# EasyEDA Pro project ProProject_OSC_Ver0.2_2023-11-09.epro, board PCB7
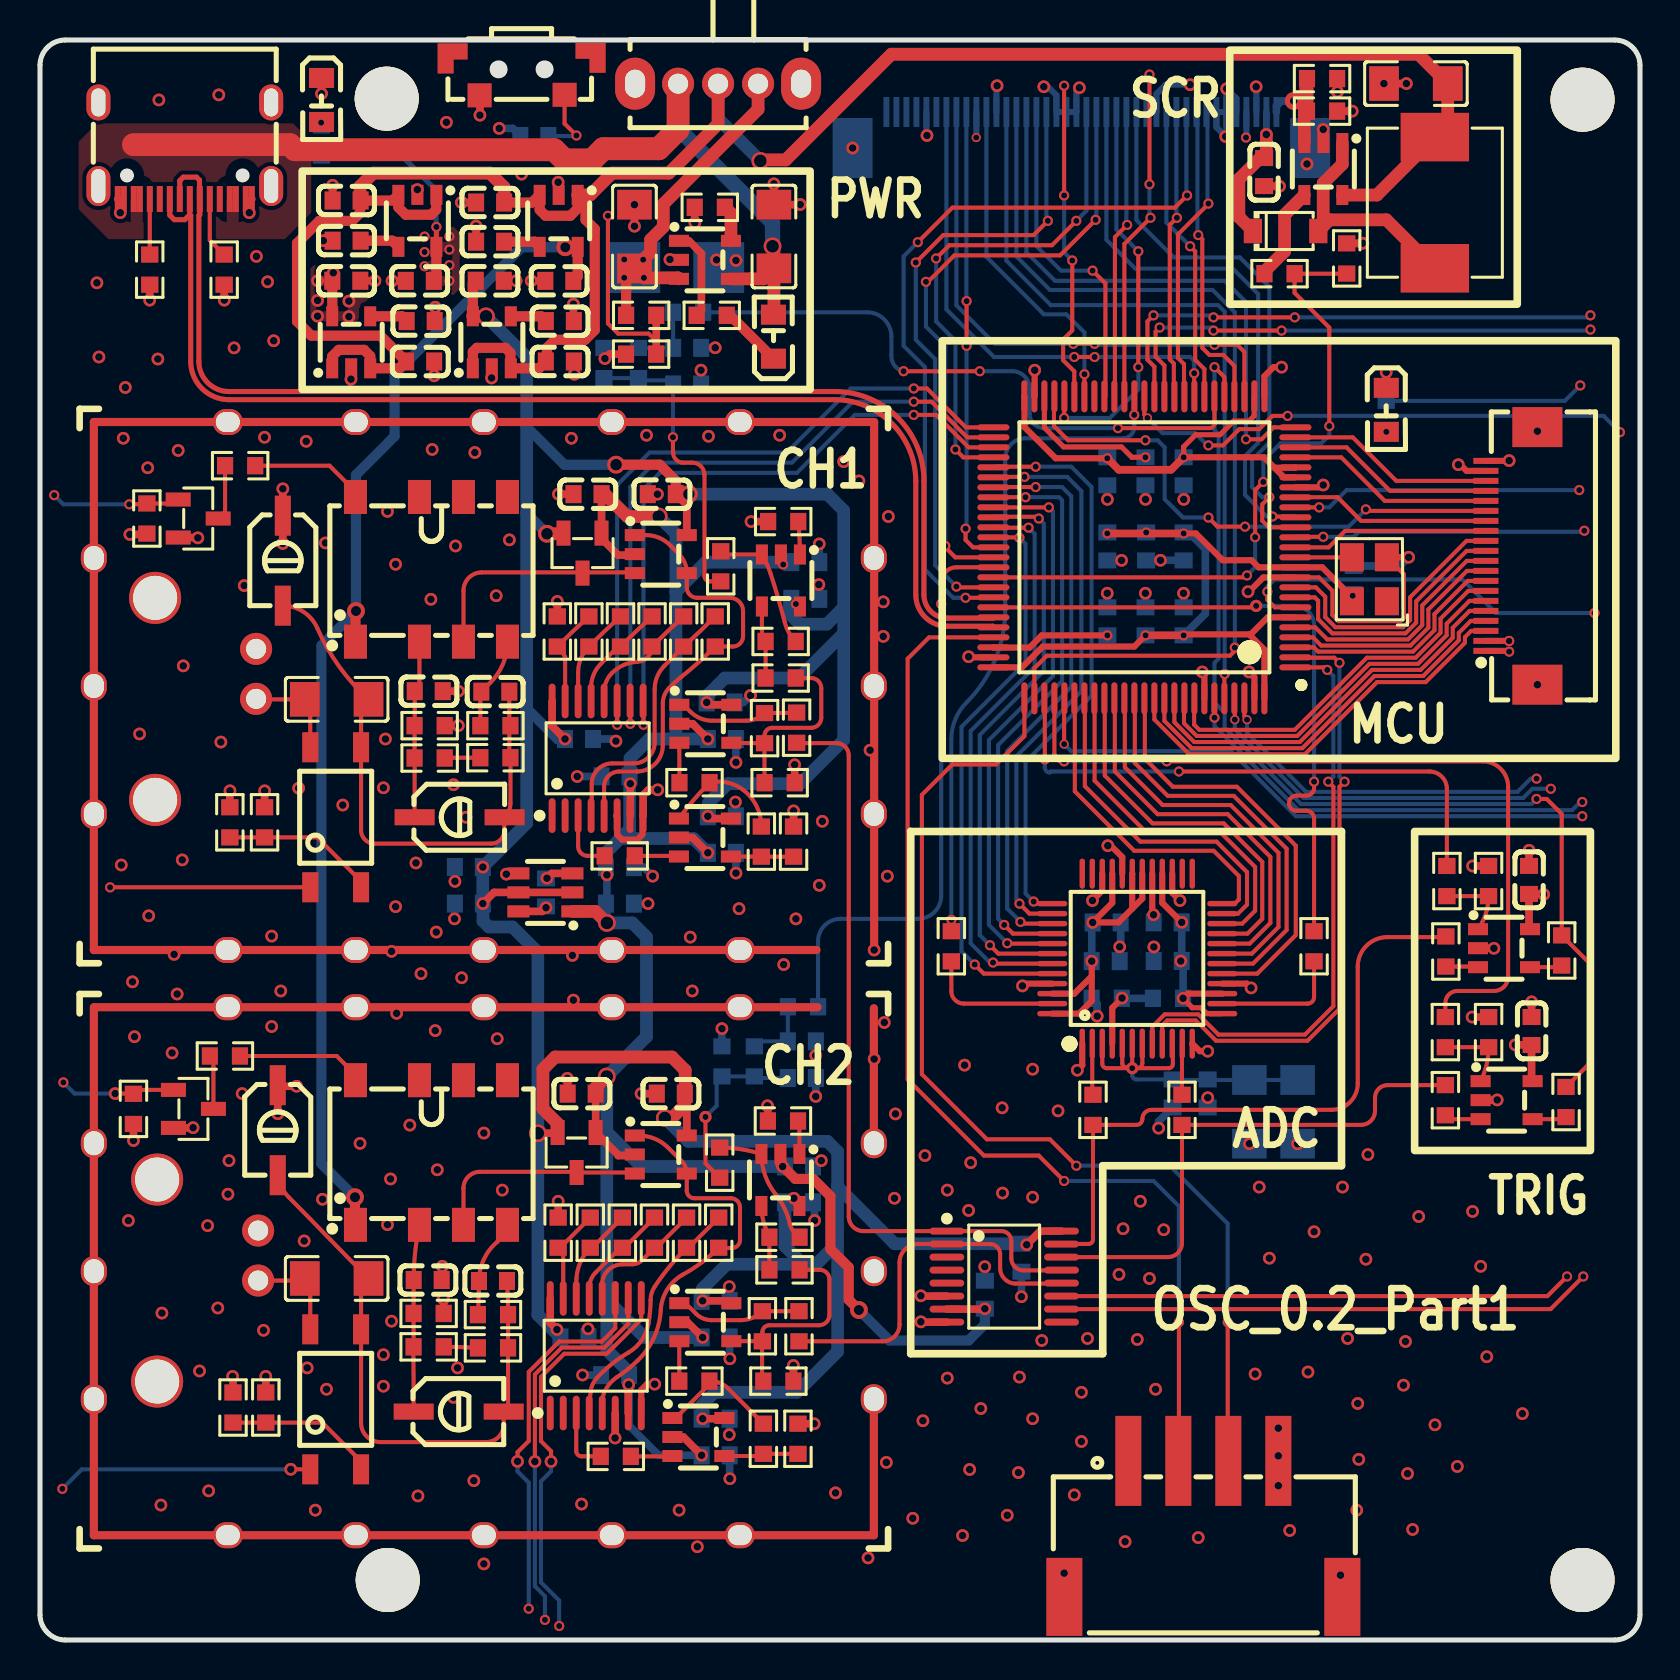
[diagram p10: board, top side]
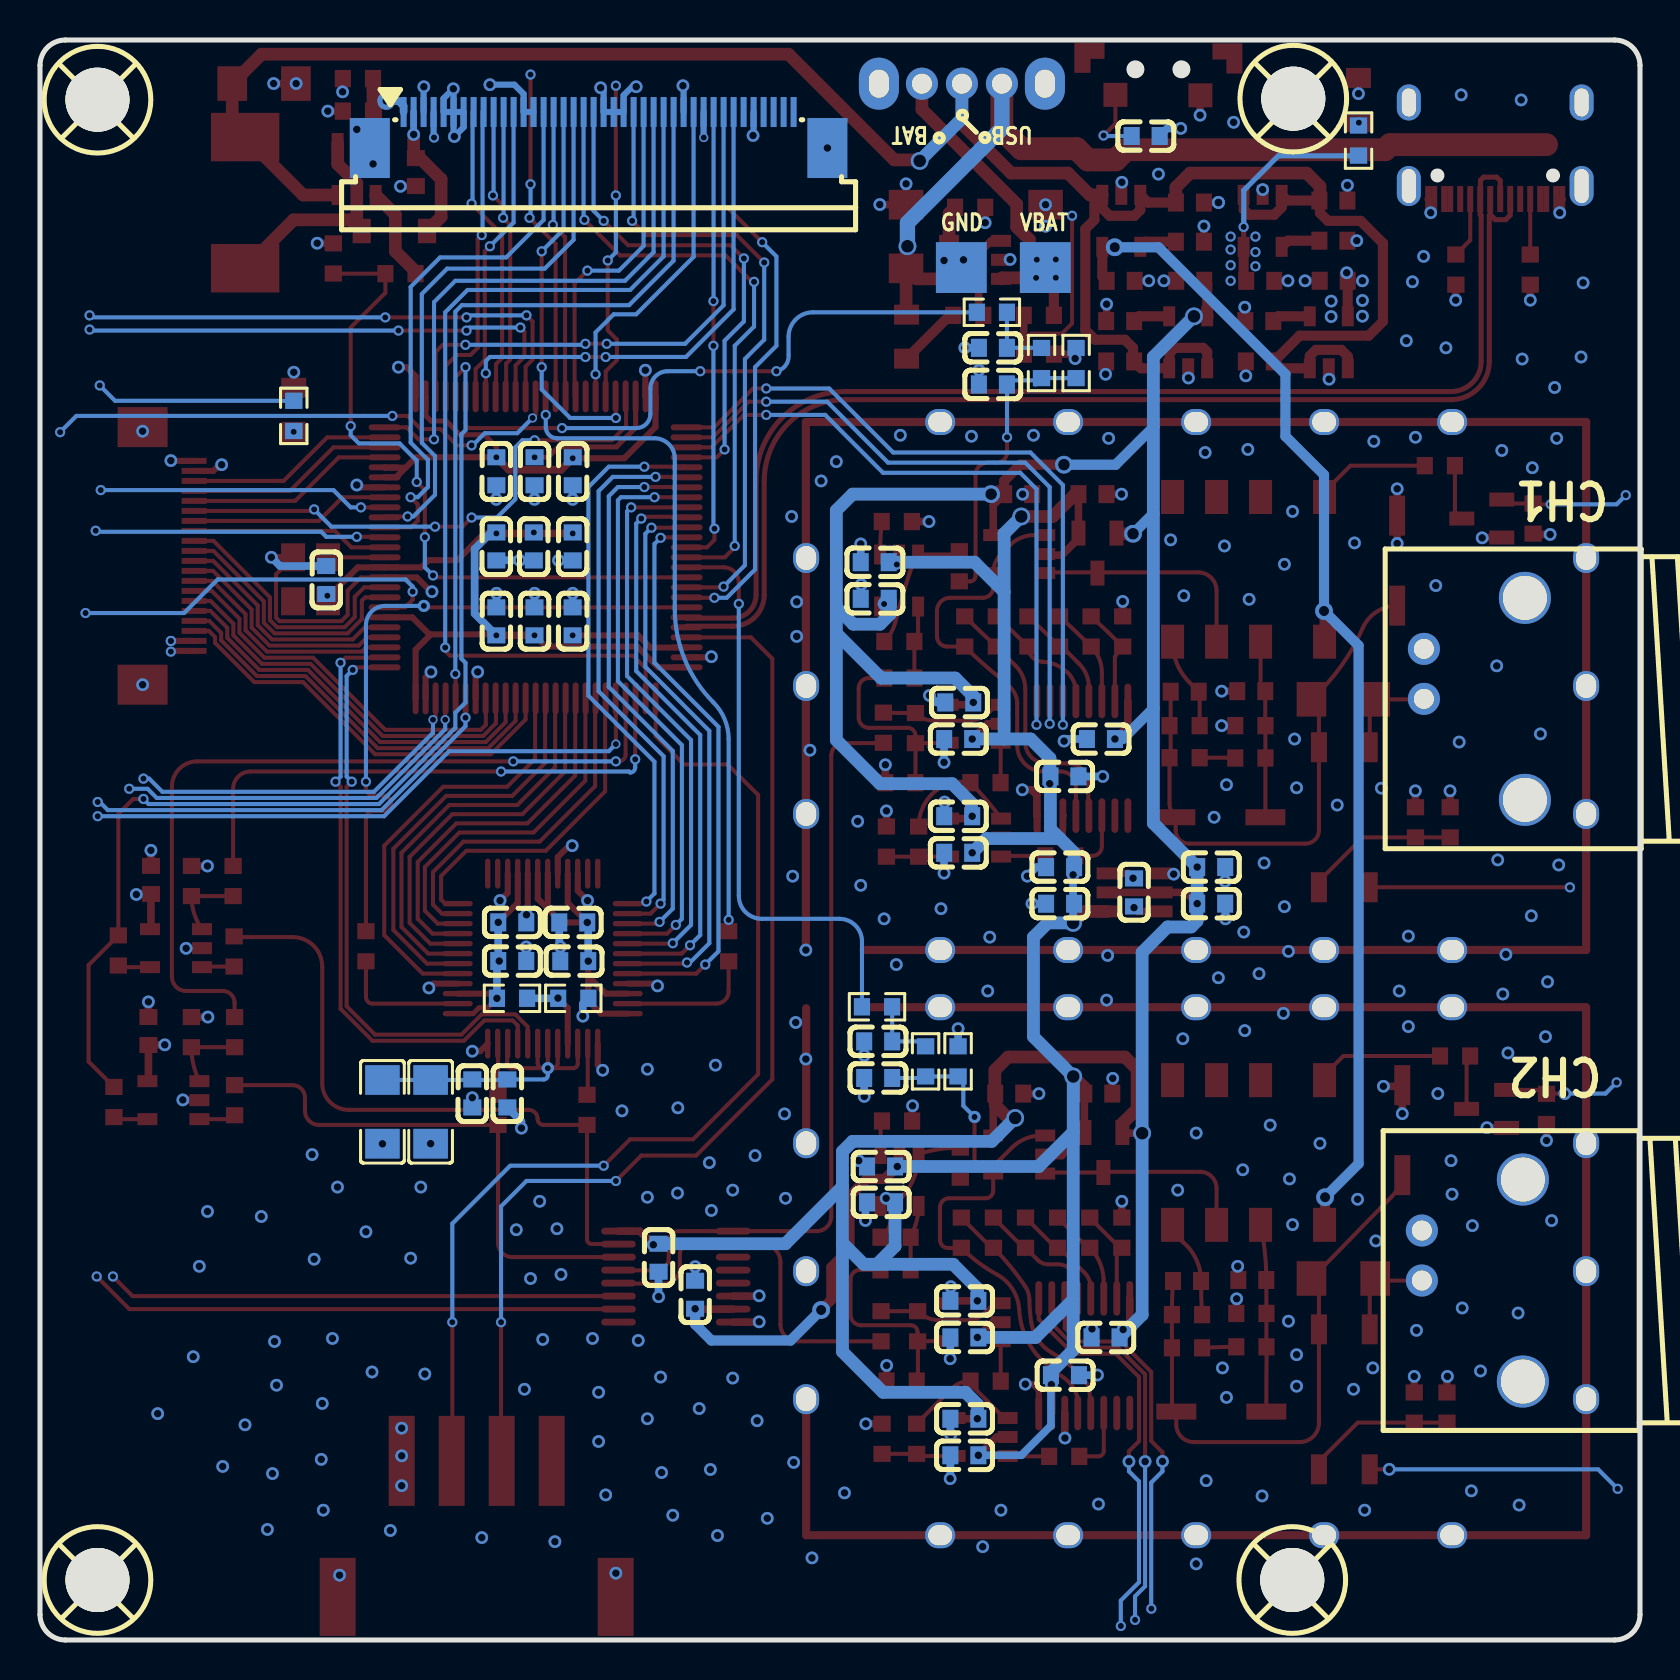
[diagram p11: board, bottom side, seen from below]

Outline 80 x 80 mm; copper layers: Top Layer, Inner1, Inner2, Bottom Layer. Coordinates in mm from the lower left corner of the outline.
Outline path: 0,78.73 0,1.27 arc(0.37,0.37) 1.27,0 78.73,0 arc(79.63,0.37) 80,1.27 80,78.73 arc(79.63,79.63) 78.73,80 1.27,80 arc(0.37,79.63) 0,78.73
Stack: Top Layer 0.035mm 外层铜厚1oz / Dielectric1 0.2104mm 7628 RC49% 8.6mil / Inner1 0.0152mm 内层铜厚 / Dielectric2 1.065mm 1.1mm H/HOZ 含铜 / Inner2 0.0152mm 内层铜厚 / Dielectric3 0.2104mm 7628 RC49% 8.6mil / Bottom Layer 0.035mm 外层铜厚1oz

## Design rules (mm)
net USB_P: DP1
net USB_N: DP1
template: 自定义配置
spacing copperThickness1oz (default): track to track 0.102, other pairs 0.152 to 0.3
spacing copperThickness2oz: track to track 0.203, other pairs 0.152 to 0.3
track width copperThickness1oz (default): min 0.127, default 0.381, max 2.54
track width copperThickness2oz: min 0.203, default 0.254, max 2.54
differential pair differentialPair (default): width min 0.127, default 0.254, max 2.54; gap min 0.152, default 0.152
via viaSize (default): diameter min 0.099, default 0.635, max 10; hole min 0.099, default 0.381, max 6.299

## Placement (name value [footprint] x y rotation side)
C1  106  [C1206]  29.72 70.17 270 top
C2  106  [C1206]  36.7 70.17 270 top
C4  100nF  [C0603]  57.18 54.68 90 bottom
C5  100nF  [C0603]  57.18 58.44 90 bottom
C6  100nF  [C0603]  53.36 58.44 90 bottom
C7  100nF  [C0603]  55.31 54.68 90 bottom
C8  100nF  [C0603]  55.28 50.93 270 bottom
C10  100nF  [C0603]  55.27 58.44 90 bottom
C11  100nF  [C0603]  53.37 50.93 270 bottom
C12  100nF  [C0603]  24.72 75.2 0 bottom
C13  100nF  [C0603]  65.69 53 270 bottom
C14  100nF  [C0603]  57.18 50.93 270 bottom
C15  100nF  [C0603]  53.36 54.68 90 bottom
C16  100nF  [C0603]  15.33 71.97 0 top
C17  100nF  [C0603]  18.99 67.96 0 top
C18  100nF  [C0603]  15.33 69.97 0 top
C19  100nF  [C0603]  61.21 73.4 90 top
C20  22n  [C1206]  14.83 18.08 0 top
C24  106  [C1206]  68.79 77.82 0 top
C25  22n  [C1206]  14.83 47.03 0 top
C26  2-6p  [CAP-ADJ-SMD_L4.5-W3.2-L]  12.14 53.97 270 top
C27  2-6p  [CAP-ADJ-SMD_L4.5-W3.2-L]  20.98 41.14 0 top
C28  120p  [C0603]  19.44 47.44 180 top
C29  10n  [C0603]  22.77 47.42 0 top
C30  100nF  [C0603]  27.38 57.29 180 top
C31  100nF  [C0603]  31.09 57.29 180 top
C32  100nF  [C0603]  28.78 43.18 0 bottom
C33  100nF  [C0603]  26.95 45.05 0 bottom
C34  100nF  [C0603]  34.09 41.19 0 bottom
C35  100nF  [C0603]  34.09 39.36 0 bottom
C36  100nF  [C0603]  34.04 46.88 0 bottom
C37  100nF  [C0603]  34.09 45.05 0 bottom
C38  100nF  [C0603]  38.26 53.89 0 bottom
C39  100nF  [C0603]  38.26 52.06 0 bottom
C40  105  [C0603]  32.35 64.61 180 bottom
C41  105  [C0603]  32.35 62.78 180 bottom
C42  100nF  [C0603]  25.99 63.93 180 top
C43  100nF  [C0603]  22.49 67.96 180 top
C44  100nF  [C0603]  25.99 65.95 180 top
C47  100nF  [C0603]  19.01 63.93 180 top
C48  100nF  [C0603]  15.32 67.96 180 top
C49  100nF  [C0603]  19.04 65.95 180 top
C50  100nF  [C0603]  22.5 71.87 0 top
C51  100nF  [C0603]  25.97 67.96 0 top
C52  100nF  [C0603]  22.5 69.91 0 top
C53  3.3u  [C0603]  25.3 37.38 270 bottom
C60  106  [C1206]  62.88 26.41 90 bottom
C61  106  [C1206]  60.47 26.41 90 bottom
C62  100nF  [C0603]  58.38 27.33 90 bottom
C63  100nF  [C0603]  56.63 27.33 90 bottom
C64  100nF  [C0603]  74.45 38 270 top
C65  100nF  [C0603]  74.58 30.45 270 top
C66  100nF  [C0603]  56.39 33.95 0 bottom
C67  100nF  [C0603]  53.29 33.94 180 bottom
C68  100nF  [C0603]  53.34 35.88 180 bottom
C73  100nF  [C0603]  56.39 35.88 0 bottom
C74  2-6p  [CAP-ADJ-SMD_L4.5-W3.2-L]  11.89 25.49 270 top
C75  2-6p  [CAP-ADJ-SMD_L4.5-W3.2-L]  20.94 11.42 0 top
C76  120p  [C0603]  19.39 18 180 top
C77  10n  [C0603]  22.65 17.95 0 top
C78  100nF  [C0603]  27.09 27.32 180 top
C79  100nF  [C0603]  31.54 27.32 180 top
C80  100nF  [C0603]  28.75 13.24 0 bottom
C81  100nF  [C0603]  26.72 15.13 0 bottom
C82  100nF  [C0603]  33.78 11.06 0 bottom
C83  100nF  [C0603]  33.78 9.24 0 bottom
C84  100nF  [C0603]  33.78 16.96 0 bottom
C85  100nF  [C0603]  33.78 15.13 0 bottom
C86  100nF  [C0603]  37.95 23.68 0 bottom
C87  100nF  [C0603]  37.95 21.88 0 bottom
C88  105  [C0603]  38.09 29.93 180 bottom
C89  105  [C0603]  38.09 28.1 180 bottom
C94  100nF  [C0603]  49.07 19.11 270 bottom
C95  100nF  [C0603]  47.24 17.26 270 bottom
C96  100nF  [C0603]  21.44 38.65 0 bottom
C97  100nF  [C0603]  29 38.64 180 bottom
C98  100nF  [C0603]  21.44 36.82 0 bottom
C99  100nF  [C0603]  29 36.81 180 bottom
CN1  HC-XH-4AWT  [CONN-SMD_HC-XH-4AWT]  58.17 5.56 0 top
D1  MBR0520LT3G  [SOD-123_L2.7-W1.6-LS3.7-RD]  62.28 70.45 0 top
D2  1SS226  [SOT-23-3_L2.9-W1.3-P1.90-LS2.4-BL-2]  27.13 54.34 180 top
D3  1SS226  [SOT-23-3_L2.9-W1.3-P1.90-LS2.4-BL-2]  26.83 24.37 180 top
FPC1  FPC-05F-20PH20  [FPC-SMD_20P-P0.50_XUNPU_FPC-05F-20PH20]  73.58 54.2 90 top
J2  FPC-40贴片座子/间距0.5MM/上接/抽屉式  [FPC-SMD_40P-P0.50_FPC-40-2]  52.07 75.5 180 bottom
L2  4.7uH  [IND-SMD_L7.3-W6.6]  69.74 71.87 90 top
LED1  -  [LED_0805]  36.68 65.22 90 top
LED2  -  [LED_0805]  14.07 76.95 270 top
LED3  -  [LED_0805]  67.31 61.46 270 top
NOREF  -  [Pad_e4204]  29.74 68.62 0 top
NOREF#2  -  [Pad_e4205]  33.93 68.62 0 top
Q1  CJ2302  [SOT-23-3_L2.9-W1.3-P1.90-LS2.4-BR]  7.91 56.07 180 top
Q2  CJ2302  [SOT-23-3_L2.9-W1.3-P1.90-LS2.4-BR]  7.67 26.56 180 top
R1  10K  [R0603]  33.59 66.23 0 top
R2  1K  [R0603]  33.49 71.63 0 top
R3  5.1K  [R0603]  5.49 68.52 90 top
R4  5.1K  [R0603]  9.21 68.52 90 top
R5  20K  [R0603]  30.06 66.23 180 top
R6  20K  [R0603]  30.06 64.29 0 top
R7  10K  [R0603]  14.07 74.97 90 bottom
R10  10K  [R0603]  65.34 69.08 270 top
R11  10K  [R0603]  64.1 76.44 180 top
R12  10K  [R0603]  64.1 78.07 180 top
R13  10K  [R0603]  61.98 68.32 180 top
R17  1K  [R0603]  9.49 40.88 270 top
R18  1K  [R0603]  11.23 40.88 270 top
R19  510K  [R0603]  22.77 44.11 0 top
R20  470K  [R0603]  19.48 44.1 0 top
R21  20K  [R0603]  19.48 45.72 180 top
R22  510K  [R0603]  22.77 45.72 0 top
R23  49.9R  [R0603]  33.76 50.43 90 top
R24  24.9R  [R0603]  32.18 50.43 90 top
R25  4.99R  [R0603]  30.6 50.43 90 top
R26  10R  [R0603]  29.02 50.43 90 top
R27  4.99R  [R0603]  27.44 50.43 90 top
R28  4.99R  [R0603]  25.87 50.43 90 top
R29  0R  [R0603]  28.99 39.2 0 top
R30  80R  [R0603]  37.68 39.92 270 top
R31  180R  [R0603]  36.07 39.92 90 top
R32  0R  [R0603]  32.72 42.86 180 top
R33  180R  [R0603]  36.98 42.86 180 top
R34  220R  [R0603]  36.23 45.59 90 top
R35  1K  [R0603]  11.29 11.62 270 top
R36  22R  [R0603]  37.83 45.62 270 top
R37  100K  [R0603]  37.16 55.92 0 top
R38  300K  [R0603]  37.03 49.93 180 top
R39  100K  [R0603]  34.04 53.69 90 top
R40  10K  [R0603]  29.92 63.85 270 bottom
R41  10K  [R0603]  32.41 66.39 180 bottom
R42  7.5K  [R0603]  28.19 63.85 270 bottom
R43  10K  [R0603]  5.34 56.07 270 top
R44  0R  [R0603]  10.01 58.72 0 top
R47  68R  [R0603]  45.57 34.69 90 top
R48  0R  [R0603]  52.65 26.51 90 top
R49  68R  [R0603]  63.7 34.69 270 top
R50  0R  [R0603]  57.1 26.51 90 top
R51  0R  [R0603]  56.4 32.08 180 bottom
R52  0R  [R0603]  53.34 32.08 0 bottom
R53  10K  [R0603]  76.08 34.48 270 top
R54  10K  [R0603]  70.29 34.43 90 top
R55  10K  [R0603]  72.43 37.95 270 top
R56  68R  [R0603]  70.34 37.95 90 top
R57  10K  [R0603]  76.3 26.9 270 top
R58  10K  [R0603]  70.27 26.99 90 top
R59  10K  [R0603]  72.43 30.39 270 top
R60  68R  [R0603]  70.27 30.39 90 top
R61  1K  [R0603]  9.65 11.62 270 top
R62  510K  [R0603]  22.65 14.61 0 top
R63  470K  [R0603]  19.43 14.66 0 top
R64  20K  [R0603]  19.43 16.33 180 top
R65  510K  [R0603]  22.65 16.27 0 top
R66  4.99R  [R0603]  25.91 20.37 90 top
R67  4.99R  [R0603]  27.51 20.37 90 top
R68  10R  [R0603]  29.12 20.37 90 top
R69  4.99R  [R0603]  30.72 20.37 90 top
R70  24.9R  [R0603]  32.33 20.37 90 top
R71  49.9R  [R0603]  33.93 20.37 90 top
R72  0R  [R0603]  28.79 9.18 0 top
R73  80R  [R0603]  37.9 10.06 270 top
R74  180R  [R0603]  36.17 10.06 90 top
R75  0R  [R0603]  32.72 12.94 180 top
R76  180R  [R0603]  36.92 12.94 180 top
R77  220R  [R0603]  36.12 15.69 90 top
R78  22R  [R0603]  37.95 15.69 270 top
R79  100K  [R0603]  37.15 25.95 0 top
R80  300K  [R0603]  37.22 20.14 180 top
R81  100K  [R0603]  33.99 23.87 90 top
R82  10K  [R0603]  35.72 28.93 270 bottom
R83  10K  [R0603]  38.15 31.66 180 bottom
R84  7.5K  [R0603]  34.1 28.93 270 bottom
R85  10K  [R0603]  4.67 26.56 270 top
R86  0R  [R0603]  9.25 29.2 0 top
R87  10K  [R0603]  67.31 61.2 90 bottom
R88  220R  [R0603]  37.03 48.1 0 top
R89  220R  [R0603]  37.22 18.51 0 top
RF1  KH-BNC50-3511  [ANT-TH_KH-BNC50-3511]  8.38 17.97 90 bottom
RF3  KH-BNC50-3511  [ANT-TH_KH-BNC50-3511]  8.28 47.06 90 bottom
RLY1  G6K-2F-Y-DC5  [RELAY-SMD_G6K-2F-Y]  19.57 53.53 0 top
RLY2  G6K-2F-Y-DC5  [RELAY-SMD_G6K-2F-Y]  19.57 24.37 0 top
SW6  SK12D07VG3  [SW-TH_SK12D07VG3]  33.91 77.82 180 top
SW7  TS36CA-0.6 250gf 031  [SW-SMD_SHOU_TS36CA-0.6]  24.08 78.17 180 top
TP1  -  [M3螺丝]  17.27 77 180 bottom
TP2  -  [M3螺丝]  77.06 76.95 180 bottom
TP3  -  [M3螺丝]  17.32 2.94 180 bottom
TP4  -  [M3螺丝]  77.06 2.94 180 bottom
U1  MCP73831T-2ATI/OT  [SOT-23-5_L3.0-W1.7-P0.95-LS2.8-BR]  33.25 69.01 180 top
U2  -  [40*27*11屏蔽盖]  2.69 60.9 0 top
U3  TLP172GM(TPL,E(O  [SMD-4_L4.6-W3.7-P2.54-LS7.0-BR]  14.78 12.03 270 top
U4  GS8091-TR  [SOT-23-5_L3.0-W1.7-P0.95-LS2.8-BR]  31.04 24.27 180 top
U6  STM32H7B0VBT6  [LQFP-100_L14.0-W14.0-P0.50-LS16.0-BL]  55.22 54.63 90 top
U7  RT9193-33GB  [SOT-23-5_L3.0-W1.7-P0.95-LS2.8-BR]  18.87 70.96 90 top
U8  MP3302DJ-LF-Z  [SOT-23-5_L3.0-W1.7-P0.95-LS2.8-BR]  64.17 73.55 90 top
U9  TLP172GM(TPL,E(O  [SMD-4_L4.6-W3.7-P2.54-LS7.0-BR]  14.78 41.14 270 top
U10  CD74HC4051PWR  [TSSOP-16_L5.0-W4.4-P0.65-LS6.4-BL]  27.79 14.21 0 top
U11  GS8091-TR  [SOT-23-5_L3.0-W1.7-P0.95-LS2.8-BR]  32.92 10.15 180 top
U12  GS8091-TR  [SOT-23-5_L3.0-W1.7-P0.95-LS2.8-BR]  31.04 54.3 180 top
U14  CD74HC4051PWR  [TSSOP-16_L5.0-W4.4-P0.65-LS6.4-BL]  27.88 44.08 0 top
U15  GS8091-TR  [SOT-23-5_L3.0-W1.7-P0.95-LS2.8-BR]  33.25 40.12 180 top
U16  LMV321B-TR  [SOT-23-5_L3.0-W1.7-P0.95-LS2.8-BR]  37.02 23 90 top
U17  LMV321B-TR  [SOT-23-5_L3.0-W1.7-P0.95-LS2.8-BR]  37.05 52.97 90 top
U18  GS8091-TR  [SOT-23-5_L3.0-W1.7-P0.95-LS2.8-BR]  33.27 45.81 180 top
U19  RT9193-28GB  [SOT-23-5_L3.0-W1.7-P0.95-LS2.8-BR]  22.59 64.89 270 top
U22  RT9193-30GB  [SOT-23-5_L3.0-W1.7-P0.95-LS2.8-BR]  15.56 64.89 270 top
U23  RT9193-33GB  [SOT-23-5_L3.0-W1.7-P0.95-LS2.8-BR]  25.94 70.96 90 top
U24  SGM3204YN6G/TR  [SOT-23-6_L2.9-W1.6-P0.95-LS2.8-BR]  25.27 37.38 0 top
U26  AD9288BSTZ-40  [LQFP-48_L7.0-W7.0-P0.50-LS9.0-BL]  54.86 34.07 0 top
U27  TP1961-TR  [SOT-23-5_L3.0-W1.7-P0.95-LS2.8-BR]  73.2 34.59 180 top
U28  TP1961-TR  [SOT-23-5_L3.0-W1.7-P0.95-LS2.8-BR]  73.33 26.99 180 top
U29  GS8091-TR  [SOT-23-5_L3.0-W1.7-P0.95-LS2.8-BR]  33.27 15.89 180 top
U30  CD74HC4053PW  [TSSOP-16_L5.0-W4.4-P0.65-LS6.4-BL]  48.21 18.17 270 top
U31  -  [40*27*11屏蔽盖]  2.69 31.64 0 top
USB1  -  [USB_TYPE-C-16P]  7.37 74.46 180 top
X1  25MHz  [OSC-SMD_4P-L3.2-W2.5-BL]  66.47 53.04 90 top

## Footprints (pads in the part's own frame, mm; a bottom-side part is the same pattern mirrored in y, then rotated)
40*27*11屏蔽盖
  oval 1.3x1.5 hole 1x1.2: 1(0,-6.8) 1(0,-13.198) 1(0,-19.596) 1(39,-6.8) 1(39,-13.198) 1(39,-19.596)
  oval 1.5x1.3 hole 1.2x1: 1(6.7,0) 1(6.7,-26.4) 1(13.1,0) 1(13.1,-26.4) 1(19.5,0) 1(19.5,-26.4) 1(25.9,0) 1(25.9,-26.4) 1(32.3,0) 1(32.3,-26.4)
ANT-TH_KH-BNC50-3511
  round 1.6 hole 1: 1(0,2.525) 2(2.5,2.525)
  round 2.601 hole 2.2: 3(5.05,-2.525) 4(-5.05,-2.525)
C0603
  rect 0.8x0.9 smd: 1(-0.7,0) 2(0.7,0)
C1206
  rect 1.485x1.728 smd: 1(-1.593,0) 2(1.593,0)
CAP-ADJ-SMD_L4.5-W3.2-L
  rect 2x0.8 smd: 1(-2.25,0) 2(2.25,0)
CONN-SMD_HC-XH-4AWT
  rect 1.3x4.5 smd: 1(-3.75,3.4) 2(-1.25,3.4) 3(1.25,3.4) 4(3.75,3.4)
  rect 1.8x3.9 smd: 5(-6.95,-3.4) 6(6.95,-3.4)
FPC-SMD_20P-P0.50_XUNPU_FPC-05F-20PH20
  rect 0.3x1.25 smd: 1(-4.75,1.288) 2(-4.25,1.288) 3(-3.75,1.288) 4(-3.25,1.288) 5(-2.75,1.288) 6(-2.25,1.288) 7(-1.75,1.288) 8(-1.25,1.288) 9(-0.75,1.288) 10(-0.25,1.288) 11(0.25,1.288) 12(0.75,1.288) 13(1.25,1.288) 14(1.75,1.288) 15(2.25,1.288) 16(2.75,1.288) 17(3.25,1.288) 18(3.75,1.288) 19(4.25,1.288) 20(4.75,1.288)
  rect 2x2.5 smd: 21(6.44,-1.288) 22(-6.44,-1.288)
FPC-SMD_40P-P0.50_FPC-40-2
  rect 0.3x1.5 smd: 1(-9.75,0.9) 2(-9.25,0.9) 3(-8.75,0.9) 4(-8.25,0.9) 5(-7.75,0.9) 6(-7.25,0.9) 7(-6.75,0.9) 8(-6.25,0.9) 9(-5.75,0.9) 10(-5.25,0.9) 11(-4.75,0.9) 12(-4.25,0.9) 13(-3.75,0.9) 14(-3.25,0.9) 15(-2.75,0.9) 16(-2.25,0.9) 17(-1.75,0.9) 18(-1.25,0.9) 19(-0.75,0.9) 20(-0.25,0.9) 21(0.25,0.9) 22(0.75,0.9) 23(1.25,0.9) 24(1.75,0.9) 25(2.25,0.9) 26(2.75,0.9) 27(3.25,0.9) 28(3.75,0.9) 29(4.25,0.9) 30(4.75,0.9) 31(5.25,0.9) 32(5.75,0.9) 33(6.25,0.9) 34(6.75,0.9) 35(7.25,0.9) 36(7.75,0.9) 37(8.25,0.9) 38(8.75,0.9) 39(9.25,0.9) 40(9.75,0.9)
  rect 2x3 smd: 41(11.44,-0.9) 42(-11.44,-0.9)
IND-SMD_L7.3-W6.6
  rect 2.423x3.419 smd: 1(3.279,0) 2(-3.279,0)
LED_0805
  rect 1x1.25 smd: 1(-1.15,0.005) 2(1.05,0.005)
LQFP-48_L7.0-W7.0-P0.50-LS9.0-BL
  oval 0.27x1.5 smd: 1(-2.75,-4.25) 2(-2.25,-4.25) 3(-1.75,-4.25) 4(-1.25,-4.25) 5(-0.75,-4.25) 6(-0.25,-4.25) 7(0.25,-4.25) 8(0.75,-4.25) 9(1.25,-4.25) 10(1.75,-4.25) 11(2.25,-4.25) 12(2.75,-4.25) 25(2.75,4.25) 26(2.25,4.25) 27(1.75,4.25) 28(1.25,4.25) 29(0.75,4.25) 30(0.25,4.25) 31(-0.25,4.25) 32(-0.75,4.25) 33(-1.25,4.25) 34(-1.75,4.25) 35(-2.25,4.25) 36(-2.75,4.25)
  oval 1.5x0.27 smd: 13(4.25,-2.75) 14(4.25,-2.25) 15(4.25,-1.75) 16(4.25,-1.25) 17(4.25,-0.75) 18(4.25,-0.25) 19(4.25,0.25) 20(4.25,0.75) 21(4.25,1.25) 22(4.25,1.75) 23(4.25,2.25) 24(4.25,2.75) 37(-4.25,2.75) 38(-4.25,2.25) 39(-4.25,1.75) 40(-4.25,1.25) 41(-4.25,0.75) 42(-4.25,0.25) 43(-4.25,-0.25) 44(-4.25,-0.75) 45(-4.25,-1.25) 46(-4.25,-1.75) 47(-4.25,-2.25) 48(-4.25,-2.75)
LQFP-100_L14.0-W14.0-P0.50-LS16.0-BL
  oval 0.3x1.6 smd: 1(-6,-7.55) 2(-5.5,-7.55) 3(-5,-7.55) 4(-4.5,-7.55) 5(-4,-7.55) 6(-3.5,-7.55) 7(-3,-7.55) 8(-2.5,-7.55) 9(-2,-7.55) 10(-1.5,-7.55) 11(-1,-7.55) 12(-0.5,-7.55) 13(0,-7.55) 14(0.5,-7.55) 15(1,-7.55) 16(1.5,-7.55) 17(2,-7.55) 18(2.5,-7.55) 19(3,-7.55) 20(3.5,-7.55) 21(4,-7.55) 22(4.5,-7.55) 23(5,-7.55) 24(5.5,-7.55) 25(6,-7.55) 51(6,7.55) 52(5.5,7.55) 53(5,7.55) 54(4.5,7.55) 55(4,7.55) 56(3.5,7.55) 57(3,7.55) 58(2.5,7.55) 59(2,7.55) 60(1.5,7.55) 61(1,7.55) 62(0.5,7.55) 63(0,7.55) 64(-0.5,7.55) 65(-1,7.55) 66(-1.5,7.55) 67(-2,7.55) 68(-2.5,7.55) 69(-3,7.55) 70(-3.5,7.55) 71(-4,7.55) 72(-4.5,7.55) 73(-5,7.55) 74(-5.5,7.55) 75(-6,7.55)
  oval 1.6x0.3 smd: 26(7.55,-6) 27(7.55,-5.5) 28(7.55,-5) 29(7.55,-4.5) 30(7.55,-4) 31(7.55,-3.5) 32(7.55,-3) 33(7.55,-2.5) 34(7.55,-2) 35(7.55,-1.5) 36(7.55,-1) 37(7.55,-0.5) 38(7.55,0) 39(7.55,0.5) 40(7.55,1) 41(7.55,1.5) 42(7.55,2) 43(7.55,2.5) 44(7.55,3) 45(7.55,3.5) 46(7.55,4) 47(7.55,4.5) 48(7.55,5) 49(7.55,5.5) 50(7.55,6) 76(-7.55,6) 77(-7.55,5.5) 78(-7.55,5) 79(-7.55,4.5) 80(-7.55,4) 81(-7.55,3.5) 82(-7.55,3) 83(-7.55,2.5) 84(-7.55,2) 85(-7.55,1.5) 86(-7.55,1) 87(-7.55,0.5) 88(-7.55,0) 89(-7.55,-0.5) 90(-7.55,-1) 91(-7.55,-1.5) 92(-7.55,-2) 93(-7.55,-2.5) 94(-7.55,-3) 95(-7.55,-3.5) 96(-7.55,-4) 97(-7.55,-4.5) 98(-7.55,-5) 99(-7.55,-5.5) 100(-7.55,-6)
M3螺丝
  round 3.2 hole 3.2: 1(-0.064,0.064)
OSC-SMD_4P-L3.2-W2.5-BL
  rect 1.4x1.2 smd: 1(-1.1,-0.875) 2(1.1,-0.875) 3(1.1,0.875) 4(-1.1,0.875)
Pad_e4204
  rect 2.54x2.54 smd far side: 101(0,0)
Pad_e4205
  rect 2.54x2.54 smd far side: 102(0,0)
R0603
  rect 0.806x0.864 smd: 1(-0.753,0) 2(0.753,0)
RELAY-SMD_G6K-2F-Y
  rect 1.15x1.7 smd: 1(-3.8,-3.618) 2(-0.6,-3.618) 3(1.6,-3.618) 4(3.8,-3.618) 5(3.8,3.618) 6(1.6,3.618) 7(-0.6,3.618) 8(-3.8,3.618)
SMD-4_L4.6-W3.7-P2.54-LS7.0-BR
  rect 1.5x0.8 smd: 1(3.5,-1.27) 2(3.5,1.27) 3(-3.5,1.27) 4(-3.5,-1.27)
SOD-123_L2.7-W1.6-LS3.7-RD
  rect 0.91x1.22 smd: 1(-1.635,0) 2(1.635,0)
SOT-23-3_L2.9-W1.3-P1.90-LS2.4-BL-2
  rect 0.7x1.25 smd: 1(-0.95,-1) 2(0.95,-1) 3(0,1)
SOT-23-3_L2.9-W1.3-P1.90-LS2.4-BR
  rect 1.25x0.7 smd: 1(1,-0.95) 2(1,0.95) 3(-1,0)
SOT-23-5_L3.0-W1.7-P0.95-LS2.8-BR
  rect 1x0.6 smd: 1(1.3,-0.95) 2(1.3,0) 3(1.3,0.95) 4(-1.3,0.95) 5(-1.3,-0.95)
SOT-23-6_L2.9-W1.6-P0.95-LS2.8-BR
  rect 1.1x0.6 smd: 1(1.35,-0.95) 2(1.35,0) 3(1.35,0.95) 4(-1.35,0.95) 5(-1.35,0) 6(-1.35,-0.95)
SW-SMD_SHOU_TS36CA-0.6
  rect 1.2x1.2 smd: 1(2.1,0.938) 2(-2.15,0.912)
  custom 1.51x1.5 smd: 3(-3.45,-0.938)
  custom 1.5x1.51 smd: 4(3.45,-0.907)
SW-TH_SK12D07VG3
  oval 1.6x1.6 hole 1: 1(-2,0) 2(0,0) 3(2,0)
  oval 2x2.6 hole 1x1.4: 4(4.15,0) 5(-4.15,0)
TSSOP-16_L5.0-W4.4-P0.65-LS6.4-BL
  oval 0.343x1.732 smd: 1(-2.275,-2.866) 2(-1.625,-2.866) 3(-0.975,-2.866) 4(-0.325,-2.866) 5(0.325,-2.866) 6(0.975,-2.866) 7(1.625,-2.866) 8(2.275,-2.866) 9(2.275,2.866) 10(1.625,2.866) 11(0.975,2.866) 12(0.325,2.866) 13(-0.325,2.866) 14(-0.975,2.866) 15(-1.625,2.866) 16(-2.275,2.866)
USB_TYPE-C-16P
  oval 1.2x2 hole 0.7x1.7: 1(-4.193,1.765) 2(4.447,1.765)
  oval 1.2x1.8 hole 0.7x1.4: 3(-4.193,-2.415) 4(4.447,-2.415)
  rect 0.3x1.3 smd: A1(-3.223,2.415) A4(-2.423,2.415) A5(-1.123,2.415) A6(-0.123,2.415) A7(0.377,2.415) A8(1.377,2.415) A9(2.677,2.415) A12(3.477,2.415) B1(3.177,2.415) B4(2.377,2.415) B5(1.877,2.415) B6(0.877,2.415) B7(-0.623,2.415) B8(-1.623,2.415) B9(-2.123,2.415) B12(-2.923,2.415)

## Nets
As in the schematic, except:
GND: C1.1 C2.1 C4.1 C5.1 C6.1 C7.1 C8.1 C10.1 C11.1 C12.1 C13.1 C14.1 C15.1 C16.1 C17.1 C18.1 C19.1 C24.1 C26.1 C28.1 C30.2 C31.2 C32.1 C33.2 C34.2 C35.2 C36.2 C37.2 C38.2 C39.2 C40.1 C41.1 C42.1 C43.1 C44.1 C47.1 C48.1 C49.1 C50.1 C51.1 C52.1 C60.1 C61.1 C62.1 C63.1 C64.1 C65.1 C66.1 C67.1 C68.1 C73.1 C74.1 C76.1 C78.2 C79.2 C80.1 C81.2 C82.2 C83.2 C84.2 C85.2 C86.2 C87.2 C88.1 C89.1 C94.2 C95.1 C96.1 C97.1 C98.1 C99.1 CN1.4 CN1.5 CN1.6 FPC1.19 FPC1.20 FPC1.21 FPC1.22 J2.3 J2.5 J2.6 J2.7 J2.13 J2.14 J2.21 J2.22 J2.23 J2.29 J2.36 J2.41 J2.42 LED2.1 LED3.1 NOREF#2.102 Q1.2 Q2.2 R2.1 R3.1 R4.1 R6.1 R10.1 R11.1 R12.1 R17.1 R18.1 R21.1 R28.2 R30.1 R33.1 R35.1 R37.1 R42.1 R43.2 R52.1 R61.1 R64.1 R66.2 R73.1 R76.1 R79.1 R84.1 R85.2 RF1.2 RF1.3 RF1.4 RF3.2 RF3.3 RF3.4 SW6.4 SW6.5 SW7.1 U1.2 U2.1 U6.10 U6.19 U6.26 U6.49 U6.74 U6.94 U6.99 U7.2 U8.2 U10.6 U10.8 U14.6 U14.8 U19.2 U22.2 U23.2 U24.4 U26.1 U26.12 U26.16 U26.27 U26.29 U26.32 U26.34 U26.45 U27.2 U28.2 U30.6 U30.8 U31.1 USB1.1 USB1.2 USB1.3 USB1.4 USB1.A1 USB1.A12 USB1.B1 USB1.B12 X1.2
VBAT: C1.2 NOREF.101 R5.2 SW6.1 U1.3

Pads without a net: J2 35 37 38 39 40; RLY1 5 6 7; RLY2 5 6 7; SW7 3 4; TP1 1; TP2 1; TP3 1; TP4 1; U6 43; U10 1 2; U14 1 2; U26 25 26 35 36; U30 3 4 5 9; USB1 A8 B8; X1 1

## Via types
v1: diameter 0.508, hole 0.305, Top Layer to Bottom Layer, 159 vias
v2: diameter 0.457, hole 0.305, Top Layer to Bottom Layer, 5 vias
v3: diameter 0.635, hole 0.381, Top Layer to Bottom Layer, 375 vias
v4: diameter 0.61, hole 0.305, Top Layer to Bottom Layer, 3 vias
v5: diameter 0.889, hole 0.635, Top Layer to Bottom Layer, 8 vias
v6: diameter 0.889, hole 0.381, Top Layer to Bottom Layer, 1 via
v7: diameter 0.889, hole 0.584, Top Layer to Bottom Layer, 3 vias
v8: diameter 0.889, hole 0.508, Top Layer to Bottom Layer, 4 vias

## Routing (per net, layer and track width the routed paths; a pad name or vN(x,y) marks a point on that pad's centre or on a via; arc(x,y) is an arc through that point)
+2V8: length 200.6
  Top Layer w0.381: 32.24,27.32 32.34,27.22 U4.5 ; U17.5 37.87,51.8 v1(37.8,51.8) ; C31.1 32.34,56.74 U12.5 ; v3(25.85,15.52) 25.51,15.86 U10.16 ; v3(22.14,36.82) 22.7,37.38 U24.5 U24.2 ; U18.5 33.45,46.76 v3(33.34,46.88) ; U15.5 33.51,41.07 v3(33.39,41.19) ; v3(37.69,22.09) 37.69,21.98 U16.5 ; U29.5 34.45,16.96 v3(33.13,16.96) ; v3(26.25,45.05) 25.61,45.7 U14.16 ; U11.5 34.18,11.06 v3(33.13,11.06) ; U30.16 50.02,20.44 v3(49.33,19.76) ; v5(24.89,25.34) 25.85,25.34 D3.2
  Top Layer w0.508: U19.5 21.64,67.82 21.79,67.96 ; v7(32.44,57.29) C31.1 31.79,57.96 30.99,58.77 v7(28.8,58.77)
  Top Layer w0.635: U19.5 21.65,66.18 v5(22.3,66.18) ; v7(25.35,55.31) 26.04,55.31 26.09,55.26 26.18,55.34 ; D3.2 25.88,25.82 25.15,26.56 25.15,28.54 25.76,29.15 31.6,29.15 32.26,28.49 32.26,27.34 32.24,27.32 32.24,26.74 31.6,26.1 v5(31.24,26.1)
  Bottom Layer w0.381: v3(37.69,22.09) 37.49,21.88 C87.1 ; 22.15,38.64 v3(22.14,38.65) ; 26.02,15.13 26.02,15.35 v3(25.85,15.52) ; 37.8,51.83 C39.1
  Bottom Layer w0.508: v7(28.8,58.77) 26.21,58.77 24.33,60.64 ; v3(26.25,45.05) 25.87,45.05 24.33,46.58 ; v7(25.35,55.31) 24.33,56.33
  Bottom Layer w0.635: 38.15,18.79 34.34,18.79 33.12,17.57 33.12,17 C84.1 ; 38.15,18.79 38.81,18.79 39.88,19.85 ; 38.15,18.79 37.25,19.69 C87.1 ; 39.88,19.85 39.88,14.42 37.85,12.38 33.73,12.38 33.12,11.78 33.12,11.1 C82.1 ; 39.88,19.85 39.88,22.67 ; v3(33.34,46.88) 33.34,47.19 34.24,48.1 37.95,48.1 40.18,50.33 ; 40.18,50.33 40.18,51.63 ; 40.18,50.33 40.18,45 38,42.81 34.39,42.81 33.43,41.85 33.43,41.22 v3(33.39,41.19) ; v5(31.24,26.1) 32.41,24.93 39.37,24.93 39.88,24.42 39.88,22.67 ; 40.18,51.63 39.34,50.79 38,50.79 37.49,51.3 37.49,51.99 C39.1 ; 40.18,51.63 40.18,56.48 39.37,57.29 v7(32.44,57.29) ; 26.02,15.13 24.89,16.26 v5(24.89,25.34) 24.89,34.38 23.62,35.65 22.45,35.65 22.15,35.95 22.15,36.81 v3(22.14,36.82) v3(22.14,38.65) 24.33,40.84 24.33,64.15 v5(22.3,66.18) ; 39.88,22.67 42.73,19.81 C94.1 ; 37.8,51.83 v1(37.8,51.8)
+3V: length 36.9
  Top Layer w0.254: v3(57.15,32.08) 57.61,31.63 57.61,31.61 58.05,31.61 58.34,31.32 U26.13
  Top Layer w0.305: 54.61,36.57 55.11,37.07 U26.30 ; 54.61,36.57 53.92,35.88 v3(52.64,35.88) 53.61,36.86 U26.33 ; 54.61,36.57 54.61,38.31 U26.31 ; 52.59,33.19 v3(52.59,33.94) ; 52.59,33.19 51.71,32.32 U26.46 ; 52.59,33.19 52.59,31.95 51.95,31.32 U26.48 ; v3(57.09,35.88) 56.11,36.86 U26.28 ; v3(57.15,32.08) 57.39,32.32 U26.15
  Top Layer w0.381: v3(73.76,29.76) 74.57,29.76 C65.2 74.58,27.99 U28.5 ; v3(71.63,38.7) 72.43,38.7 R55.1 ; v3(75.18,37.28) 75.16,37.3 C64.2 74.45,35.59 74.5,35.54 ; R59.1 v3(71.61,31.15)
  Top Layer w0.508: U22.5 14.61,66.19 C48.2
  Bottom Layer w0.381: v3(57.09,35.88) C66.2 ; v3(57.04,33.95) 57.15,33.83 v3(57.15,32.08) ; v3(52.64,35.88) 52.59,35.83 v3(52.59,33.94)
  vias: v3(13.88,67.96) v3(13.88,66.98) v3(13.88,66.19) v3(14.67,68.36) v3(15.44,66.94) v3(15.44,66.17)
+3V3: length 78.9
  Top Layer w0.254: U7.5 v1(19.82,70.65) ; v1(57.18,59.14) 57.18,59.66 57.78,60.26 59,60.26 59.69,60.95 60.45,60.95 60.71,61.2 60.71,62.17 U6.27
  Top Layer w0.305: v1(73.46,49.42) 73.42,49.45 FPC1.1 ; U6.100 61.22,49.51 60.45,50.28 ; X1.4 65.59,52.15 64.11,53.63 U6.11 60.93,53.63 60.57,53.99 59.13,53.99 57.79,55.33 v1(57.18,55.33) ; v1(53.36,59.09) 50.78,59.09 49.22,60.64 49.22,62.18 U6.50 ; 61.72,58.61 62.75,58.61 U6.21 ; 61.72,58.61 61.2,59.14 v1(57.18,59.14) ; 61.72,58.61 62.2,58.13 U6.20 ; 60.45,50.28 60.53,50.28 61.39,51.13 U6.6 ; 60.45,50.28 57.23,50.28 v1(57.18,50.23) ; v1(73.46,49.95) 73.45,49.95 FPC1.2 ; U6.75 49.1,48.63 50.14,49.67 54.72,49.67 v1(55.28,50.23)
  Top Layer w0.381: v1(57.18,50.23) v1(55.28,50.23) ; v1(53.36,55.33) v1(57.18,55.33) ; v1(57.18,59.14) 56.56,58.51 53.94,58.51 v1(53.36,59.09)
  Top Layer w0.508: C17.2 19.82,68.09 U7.5
  Bottom Layer w0.254: R7.1 14.08,74.21 18.09,74.21 19.81,72.48 19.81,70.65 v1(19.82,70.65)
  Bottom Layer w0.305: J2.31 46.82,75.13 v2(46.81,75.12) ; v1(60.3,75.12) 60.32,75.14 J2.4
  Bottom Layer w0.381: v1(57.18,55.33) 57.49,55.33 58.27,54.55 58.27,51.32 v1(57.18,50.23)
  vias: v1(19.23,70.17) v1(19.23,69.4) v1(19.23,68.69) v1(20.47,70.17) v1(20.47,69.52) v1(20.47,68.74) v1(20.47,67.96) v1(55.31,55.38) v1(65.63,52.21)
+5V: length 59.9
  Top Layer w0.508: C51.2 26.88,68.18 U23.5 26.86,69.64 v8(26.26,69.64) ; RLY1.1 15.77,51.42 v8(15.8,51.45) ; RLY2.1 15.75,20.78 v8(15.75,22.14)
  Bottom Layer w0.508: v8(26.26,69.64) 24.08,69.64 17.73,63.29 17.73,60.19 15.8,58.26 v8(15.8,51.45) 14.07,49.72 14.07,23.81 v8(15.75,22.14)
-2V8: length 129.7
  Top Layer w0.381: v3(29.43,12.77) 29.41,12.75 U10.7 ; v3(33.39,45.05) 32.63,45.81 31.97,45.81 ; v1(37.16,53.77) 37.05,53.89 U17.2 ; v3(29.51,42.81) 29.51,41.23 U14.7 ; v3(33.39,39.36) 32.63,40.12 31.94,40.12 ; U4.2 29.69,24.22 28.91,24.22 28.91,24.26 27.78,25.38 ; 27.78,25.38 C78.1 ; 27.78,25.38 D3.1 ; v3(37.13,23.67) 37.13,23.69 ; C30.1 D2.1 28.08,55.07 28.91,54.24 29.69,54.24 U12.2 ; U11.2 32.17,10.15 v3(33.08,9.24) ; v3(47.24,16.56) 47.23,16.54 U30.7 ; 31.97,15.89 32.37,15.89 v3(33.13,15.13)
  Top Layer w0.508: U16.2 37.02,23.8 37.13,23.69 37.77,23.05 38.66,23.05 39.52,22.19 39.52,19.55 40.44,18.63 40.44,17.01 v8(40.94,16.5)
  Top Layer w0.635: U24.1 27.77,36.43 v5(28.35,35.86) ; C78.1 27.78,27.62 v5(28.34,28.18) ; v5(30.94,56.17) 29.36,56.17 28.25,57.29 C30.1
  Bottom Layer w0.381: C97.2 28.35,38.59 v3(28.35,38.26) v5(28.35,35.86) ; v1(37.16,53.77) 37.45,53.77 37.46,53.79 ; v3(29.51,42.81) 29.51,43.15 29.5,43.16 C32.2 ; 29.45,12.79 v3(29.43,12.77) ; 29.45,12.79 29.45,10.72 30.94,9.24 v3(33.08,9.24) ; 29.45,12.79 C80.2
  Bottom Layer w0.508: v8(40.94,16.5) 42.47,14.98 46.43,14.98 47.24,15.79 v3(47.24,16.56)
  Bottom Layer w0.635: 29.48,43.13 C32.2 ; 29.48,43.13 29.5,43.16 29.5,44.09 30.46,45.05 31.79,45.05 ; 29.48,43.13 29.48,40.55 29,40.07 ; v3(33.39,39.36) 32.68,40.07 29,40.07 ; 37.46,53.79 C38.1 33.28,53.89 31.79,52.41 ; 31.79,45.05 v3(33.39,45.05) ; 31.79,45.05 31.79,52.41 ; 28.34,17.02 30.23,15.13 C85.1 ; 28.34,17.02 28.34,14.5 29.43,13.4 v3(29.43,12.77) ; 28.34,17.02 28.34,25.4 ; v5(28.35,35.86) 29.62,35.86 30.33,35.14 30.33,30.17 v5(28.34,28.18) 28.34,25.4 ; v5(30.94,56.17) 31.79,55.32 31.79,52.41 ; 29,40.07 28.3,39.36 C97.2 ; 28.34,25.4 30.06,23.68 C86.1
GND: length 404.4
  Top Layer w0.203: U6.10 62.78,53.13 63.96,53.13 64.62,52.47 64.62,51.25 64.93,50.94 68.02,50.94 68.2,51.12 68.2,53.28 X1.2
  Top Layer w0.305: v3(49.12,32.7) 49.24,32.82 U26.45 ; U26.12 57.99,29.44 v3(58.39,29.44) ; FPC1.20 73.44,58.95 v3(73.46,58.97) ; v3(57,36.97) 56.61,37.36 U26.27 ; U6.49 49.73,62.2 v3(49.73,63.49) ; v3(64.16,57.75) 64.04,57.63 U6.19 ; U6.94 58.22,48.3 v3(58.12,48.4) ; U6.74 46.46,49.13 v3(46.43,49.16) ; U10.8 30.06,12.51 30.35,12.79 v3(30.73,12.79) ; U6.99 60.72,48.13 v3(60.45,48.4) ; FPC1.19 71.33,58.45 71.02,58.77 v3(70.92,58.77) ; U26.1 52.11,28.74 v3(51.87,28.49) ; U26.32 54.11,39.15 53.54,39.72 v3(53.39,39.72) ; v3(60.55,32.6) 60.34,32.82 U26.16 ; U26.29 55.61,36.32 v3(55.68,36.26) ; 62.78,53.13 61.16,53.13 60.45,52.42 v3(60.4,52.42) ; v3(52.62,36.97) 53.11,37.46 U26.34 ; v3(62.08,63.64) 61.67,63.64 61.22,63.19 U6.26 ; 28.81,41.22 28.85,41.17 28.85,40.27 29.11,40.02 29.87,40.02 30.12,40.27 30.12,41.2 30.11,41.22
  Top Layer w0.33: X1.2 v3(68.43,54.14)
  Top Layer w0.381: v3(21.08,71.87) 21.8,71.87 C50.1 ; C42.1 26.72,63.9 v3(26.72,63.29) ; R6.1 28.47,64.29 v3(28.25,64.07) ; R35.1 v3(11.29,13.18) ; v3(74.58,31.91) 74.58,31.9 C65.1 ; v3(11.89,26.32) C74.1 11.94,27.69 v3(12.83,27.69) ; v3(38.71,10.81) 38.71,10.81 R73.1 ; U28.2 72.85,26.99 v3(72.86,27) ; v3(74.45,39.48) 74.45,38.71 C64.1 ; R33.1 37.74,43.76 v3(37.73,43.76) ; v3(21.8,70.7) 21.8,69.92 ; C17.1 18.29,67.96 v3(17.6,67.96) ; 26.39,27.32 26.39,28.06 v3(26.37,28.08) ; v3(22.58,63.1) 22.59,63.11 U19.2 ; 6.91,55.12 7.88,55.12 v3(7.89,55.11) ; 23.92,38.33 23.89,38.29 v3(23.32,38.29) ; v3(64.16,75.53) 64.17,75.52 U8.2 ; R64.1 20.19,17.04 v3(20.17,17.06) ; v3(28.75,10.1) 28.76,10.11 U10.6 ; R21.1 v3(20.92,45.72) ; v3(37.67,13.73) 37.67,13.72 R76.1 ; R66.2 v3(25.91,21.94) ; C44.1 26.67,65.97 v3(26.67,66.79) ; R11.1 v3(65.61,76.44) ; R28.2 v3(25.87,51.93) ; v3(25.91,72.89) 25.94,72.86 U23.2 ; R30.1 v3(37.68,41.46) ; SW7.1 22,77.22 v3(22,76.24) ; v3(64.87,77.41) 64.87,78.06 R12.1 ; R10.1 66.13,69.83 v3(66.14,69.84) ; v3(44.04,17.21) 44.06,17.19 U30.6 ; v3(30.87,57.29) 30.87,57.29 C31.2 ; v3(67.19,77.82) v3(68.32,77.82) ; v3(9.21,66.99) 9.21,67.76 R4.1 ; v3(36.7,72.81) C2.1 38,71.77 v3(38.01,71.77) ; v3(10.47,71.36) 10.47,71.92 USB1.A1 ; v3(9.63,13.18) 9.65,13.16 R61.1 ; v3(5.49,66.99) R3.1 ; U22.2 15.56,63.05 v3(15.55,63.04) ; R17.1 9.49,42.45 v3(9.5,42.46) ; 36.4,25.95 36.4,26.69 v3(36.37,26.71) ; v3(32.74,70.86) 32.74,70.87 R2.1 ; v3(67.31,63.39) 67.31,62.61 LED3.1 ; v3(12.14,57.56) C26.1 v3(12.14,54.83) ; 26.68,57.29 v3(25.92,57.29) ; v3(30.05,27.32) 30.84,27.32 C79.2 ; C43.1 23.8,67.96 v3(23.81,67.96) ; LED2.1 v3(14.08,77.32) ; v3(19.76,66.64) 19.76,65.97 C49.1 ; v3(44.04,15.91) 44.06,15.89 U30.8 ; v3(20.12,18.68) 20.12,18.03 C76.1 ; v3(11.23,42.46) 11.23,41.64 R18.1 ; U14.8 30.16,42.24 30.42,42.51 v3(30.89,42.51) ; C19.1 61.97,72.7 v3(61.98,72.69) ; v3(4.67,24.97) R85.2 ; v3(29.72,70.69) v3(29.72,71.77) ; v3(16.75,67.96) 16.75,67.96 C48.1 ; C28.1 v3(20.92,47.44) ; R37.1 v3(35.55,55.92) ; 14.63,71.97 v3(14.63,72.74) ; R43.2 5.3,55.28 v3(4.49,55.28) ; Q2.2 7.64,25.61 v3(7.65,25.62) ; C51.1 25.26,67.96 v3(24.56,67.96) ; U27.2 72.69,34.59 v3(72.69,34.58) ; v3(14.16,69.97) 14.63,69.97 ; v3(19.71,63.21) C47.1 ; v3(4.01,71.36) 4.01,71.92 USB1.A12
  Top Layer w0.406: 38.82,34.5 2.69,34.5 2.69,60.9 41.71,60.9 v3(41.71,34.5) 41.69,34.5 ; 2.69,31.64 2.69,5.24 41.69,5.24 41.69,11.99 ; 38.88,31.64 2.74,31.64 ; 41.69,24.84 41.69,31.59
  Bottom Layer w0.305: J2.14 J2.13 55.82,77.3 56.28,77.77 v3(57.51,77.77) ; J2.6 J2.7 58.82,75.64 v3(59.28,75.17) 59.32,75.21 J2.6 ; J2.6 59.32,77.55 v3(59.33,77.56) 59.82,77.08 J2.5 J2.6 ; J2.3 60.82,77.65 v3(60.81,77.66) ; J2.29 47.82,77.68 v3(47.85,77.71) ; J2.36 44.32,75.25 v3(44.35,75.22) ; v3(50.19,77.66) 50.39,77.66 50.82,77.24 J2.23 J2.22 J2.21 51.82,77.46 v3(51.97,77.61)
  Bottom Layer w0.381: R52.1 52.86,31.81 v3(52.86,31.19) ; C80.1 27.13,13.24 v3(27.13,13.25) ; v3(55.27,52.34) 55.28,52.33 C8.1 ; v3(34.46,10.26) 34.48,10.28 C82.2 ; v3(53.37,57.03) 53.37,57.73 C6.1 ; v3(30.63,38.19) 30.18,38.64 C97.1 ; C38.2 38.96,54.8 ; v3(20.75,37.93) 20.75,38.64 C96.1 ; v3(47.24,18.67) 47.24,18.66 C95.1 ; C62.1 58.39,26.63 v3(58.39,27.12) ; v3(33.05,63.49) 33.05,63.49 C41.1 ; v3(38.73,20.97) 38.73,21.8 C87.2 ; C4.1 57.17,53.99 v3(56.02,53.99) 56.02,53.98 C7.1 ; C10.1 55.28,57.73 v3(55.28,57.03) ; v3(20.73,36.06) 20.73,36.81 C98.1 ; C83.2 34.48,8.08 v3(34.49,8.07) ; C88.1 38.79,29.23 v3(38.79,29.23) ; v3(53.36,52.34) 53.37,52.33 C11.1 ; v3(57.19,57.03) 57.19,57.73 C5.1 ; v3(33.76,64.61) 33.75,64.61 C40.1 ; v3(54.08,53.98) 54.07,53.98 C15.1 ; R42.1 28.25,64.55 v3(28.25,64.07) ; C85.2 34.48,14.07 v3(34.49,14.06) ; v3(34.8,38.34) 34.8,39.35 C35.2 ; C63.1 55.93,25.93 v3(55.93,25.59) ; C33.2 28.69,45.05 v3(28.8,44.95) ; v3(55.69,34.65) 55.69,33.95 C66.1 ; v3(55.68,36.26) 55.69,36.25 C73.1 ; C37.2 34.8,45.04 v3(34.8,43.88) ; v3(26.86,43.18) 28.07,43.18 C32.1 ; v3(22.96,75.58) 23.64,75.58 24.02,75.2 ; C39.2 38.96,52.75 v3(38.94,52.77) ; C67.1 53.99,34.65 v3(53.98,34.66) 54.04,34.71 C68.1 ; v3(34.77,41.9) 34.79,41.88 C34.2 ; C81.2 27.42,15.54 v3(27.4,15.56) ; v3(39.06,23.97) 38.77,23.68 C86.2 ; C13.1 68,53.7 v3(68.43,54.14) ; C99.1 30.4,36.81 v3(30.4,36.82) ; v3(34.1,30.57) R84.1 ; C94.2 49.07,17.17 v3(49.07,17.16) ; C36.2 35.18,46.88 v3(35.53,47.23) ; C84.2 34.48,17.65 v3(34.46,17.67) ; v3(38.79,27.18) 38.79,27.18 C89.1 ; v3(57.18,52.34) 57.18,52.33 C14.1
  vias: v3(2.84,67.86) v3(2.95,64.15) v3(4.06,38.75) v3(4.17,60.09) v3(4.27,62.63) v3(4.42,20.97) v3(4.62,32.91) v3(4.72,30.17) v3(4.98,45.3) v3(5.39,58.61) v3(5.44,36.21) v3(5.94,77) v3(5.89,64.05) v3(6.05,6.75) v3(6.1,16.35) v3(6.6,29.35) v3(6.71,34.28) v3(6.91,59.48) v3(6.86,32.3) v3(7.11,39) v3(7.16,48.71) v3(7.98,13.45) v3(8.38,20.72) v3(8.43,7.46) v3(8.94,77.26) v3(8.89,16.6) v3(9.04,44.9) v3(9.45,23.97) v3(9.4,22.29) v3(9.7,64.61) v3(10.11,27.32) v3(10.21,52.72) v3(10.82,69.18) v3(11.23,60.14) v3(11.18,15.48) v3(11.38,67.91) v3(11.58,35.19) v3(11.58,30.67) v3(11.68,64.96) v3(12.04,32.45) v3(12.93,42.59) v3(13.21,19.95) v3(13.31,59.93) v3(13.36,13.6) v3(13.77,6.49) v3(14.12,22.04) v3(14.28,54.85) v3(14.33,12.54) v3(15.14,41.75) v3(16,24.83) v3(17.17,42.61) v3(17.17,14.26) v3(17.17,12.69) v3(17.27,45.05) v3(17.37,56.43) v3(17.37,20.77) v3(17.53,23.05) v3(17.58,34.43) v3(17.58,15.94) v3(17.78,53.79) v3(17.78,36.67) v3(17.83,31.33) v3(18.49,25.75) v3(18.8,38.85) v3(18.87,72.52) v3(18.9,7.2) v3(19.05,33.31) v3(19.55,52.03) v3(19.61,59.53) v3(19.81,35.4) v3(19.76,30.47) v3(19.86,23.51) v3(20.32,75.89) v3(20.68,42.76) v3(20.68,12.13) v3(20.78,54.7) v3(20.88,13.6) v3(21.08,33.11) v3(21.3,41.14) v3(21.74,59.38) v3(21.69,7.97) v3(22.19,25.35) v3(22.19,3.81) v3(22.81,52.21) v3(22.86,30.06) v3(23.11,22.49) v3(23.47,55.01) v3(24.08,73.29) v3(26.57,60.09) v3(26.62,34.23) v3(26.67,31.99) v3(27.08,6.8) v3(30.33,60.24) v3(31.5,69.03) v3(31.95,6.49) v3(32.51,35.14) v3(32.61,32.45) v3(32.87,4.66) v3(33.43,60.19) v3(33.83,69.01) v3(34.8,68.98) v3(34.95,36.57) v3(36.98,60.24) v3(37.19,33.77) v3(37.79,36.06) v3(38.96,54.8) v3(38.96,37.73) v3(39.12,40.94) v3(39.78,7.36) v3(40.18,58.92) v3(40.63,74.6) v3(40.94,57.95) v3(41.4,4.1) v3(41.5,44.49) v3(41.71,29.05) v3(42.16,51.91) v3(42.16,50.18) v3(42.22,30.88) v3(42.32,8.88) v3(42.42,56.17) v3(42.37,38.19) v3(42.72,22.09) v3(42.77,26.3) v3(43.64,6.09) v3(44.15,10.96) v3(44.25,24.22) v3(45.36,22.49) v3(45.36,13.1) v3(46.13,5.22) v3(46.23,28.74) v3(46.43,21.48) v3(46.53,23.87) v3(46.48,8.52) v3(47.04,11.57) v3(48.11,26.61) v3(48.12,22.35) v3(48.36,6.24) v3(48.92,8.37) v3(48.97,13.15) v3(49.63,28.54) v3(49.63,22.14) v3(49.63,11.06) v3(50.09,14.98) v3(50.9,26.46) v3(51.21,3.34) v3(51.71,7.25) v3(52.07,12.38) v3(52.07,9.93) v3(52.38,15.08) v3(53.95,18.28) v3(54.15,20.56) v3(54.25,4.92) v3(54.86,15.03) v3(55.02,21.94) v3(55.47,18.07) v3(55.78,12.54) v3(56.19,20.51) v3(57.91,5.12) v3(60.47,24.82) v3(60.76,13.3) v3(60.96,22.65) v3(61.47,19.09) v3(61.92,10.59) v3(61.92,9.21) v3(61.92,7.72) v3(62.48,5.48) v3(62.88,24.81) v3(63.35,73.8) v3(63.4,13.4) v3(63.7,20.41) v3(65.02,3.24) v3(65.13,22.65) v3(65.38,15.08) v3(65.84,6.49) v3(65.89,11.83) v3(65.94,9.03) v3(66.29,19.04) v3(66.4,24.27) v3(68.17,12.74) v3(68.28,14.93) v3(68.38,8.32) v3(68.63,5.53) v3(68.94,21.17) v3(69.75,10.76) v3(70.87,8.68) v3(71.63,21.43) v3(72.03,18.68) v3(72.34,14.16) v3(74.12,11.32) v3(74.87,60.44) v3(74.87,47.76)
VBAT: length 16.8
  Top Layer w0.508: R5.2 29.31,68.16 C1.2
  Top Layer w0.635: U1.3 31.9,68.11 v1(30.2,68.11) C1.2 v1(30.16,69.02) 30.53,69.39 30.53,70.02 31.17,70.65 31.17,71.8 35.91,76.53 SW6.1
  vias: v1(29.21,69.03) v1(29.21,68.11)
VBUS: length 46.4
  Top Layer w0.635: C2.2 36.17,68.06 U1.4 ; C2.2 36.7,69.62 v5(36.63,69.69) ; C2.2 36.7,66.29 LED1.2
  Top Layer w1.143: 4.67,74.77 12.5,74.77 12.75,74.51 25.71,74.51 26.21,74.01 27.61,74.01 28.17,74.56 30.94,74.56 31.91,75.53 SW6.3
  Bottom Layer w0.762: v5(36.63,69.69) 36.63,70.86 31.91,75.58 SW6.3
VIN: length 117.7
  Top Layer w0.508: 16,72 16,71.35 15.61,70.96 13.97,70.96 12.85,69.84 12.85,65.93 13.56,65.22 17.02,65.22 C47.2 17.97,63.59 U22.3 16.51,64.2 16.2,64.51 14.94,64.51 14.61,64.18 U22.1 ; C16.2 17.63,71.97 U7.3 17.92,71.63 18.29,71.26 19.56,71.26 19.81,71.52 19.81,72.25 U7.1 ; U19.1 21.64,64.41 21.84,64.61 23.27,64.61 23.52,64.35 23.52,63.61 U19.3 24.95,63.59 C42.2 25.35,63.98 25.35,64.61 25.76,65.01 27.25,65.01 27.74,65.5 27.74,70.55 27.28,71.01 27.28,72.02 27.51,72.26 ; U23.1 26.88,71.58 26.52,71.21 25.28,71.21 24.99,71.5 U23.3 24.6,71.87 C50.2
  Top Layer w0.635: SW6.2 33.91,75.81 31.44,73.34 28.6,73.34 27.51,72.26 U23.1 ; U8.5 66.84,72.25 L2.1 70.39,75.79 C24.2 68.92,79.29 42.57,79.29 37.29,74.01 35.92,74.01 35.97,73.95 v5(36.02,73.95) ; C16.2 16,72 16,72.69 16.66,73.34 22.5,73.34 23.2,72.64 C50.2
  Bottom Layer w0.635: SW6.2 33.91,76.07 v5(36.02,73.95)
B3: length 31.8
  Top Layer w0.203: v1(45.82,52.67) 45.86,52.63 U6.67 ; v1(43.79,68.88) 45.16,70.25 49.68,70.25 v1(50.39,70.96)
  Bottom Layer w0.203: v1(50.39,70.96) 50.32,71.03 J2.24 ; v1(45.82,52.67) 44.75,53.74 44.75,64.05 43.79,65.01 v1(43.79,68.88)
B4: length 16.6
  Top Layer w0.203: 53.27,62.18 53.27,67.83 v1(52.63,68.47)
  Bottom Layer w0.203: v1(52.63,68.47) 51.05,68.47 49.82,69.7 J2.25
B5: length 28.6
  Top Layer w0.203: v1(60.3,60.04) 61.08,60.04 61.67,60.63 U6.25
  Bottom Layer w0.203: v1(60.3,60.04) 60.3,66.89 59.23,67.96 50.75,67.96 49.32,69.39 J2.26
B6: length 48.1
  Top Layer w0.203: v1(59.74,49.62) 59.74,49.46 59.5,49.22 50.34,49.22 49.72,48.59 U6.77
  Bottom Layer w0.203: J2.27 48.82,69.18 50.5,67.5 58.62,67.5 59.74,66.39 v1(59.74,49.62)
B7: length 38.7
  Top Layer w0.203: U6.96 59.22,48.29 v1(59.23,48.3)
  Bottom Layer w0.203: v1(59.23,48.3) 59.23,66.42 58.91,66.74 50.55,66.74 48.32,68.97 J2.28
BAT_CH_DET: length 4.6
  Top Layer w0.381: U1.1 32.45,69.96 33.07,69.33 33.07,66.47 R1.1
BL+: length 6.9
  Top Layer w0.635: v3(61.32,75.28) 61.32,74.21 C19.2 61,74.1 59.94,73.04 59.94,71.15 D1.1
  Bottom Layer w0.33: J2.2 61.32,75.28 v3(61.32,75.28)
BL-: length 6.1
  Top Layer w0.508: v6(62.69,76.95) 62.84,76.95 63.3,76.5 R11.2
  Top Layer w0.635: U8.3 63.22,76.42 63.3,76.5 63.3,77.61 63.35,77.56 R11.2
  Bottom Layer w0.381: v6(62.69,76.95) 62.08,76.95 61.82,76.69 J2.1
CC1: length 3.1
  Top Layer w0.203: R4.2 8.49,69.99 USB1.A5
CC2: length 2.8
  Top Layer w0.203: USB1.B5 5.49,69.28 R3.2
CH1_0: length 22.4
  Top Layer w0.203: U14.5 28.21,42.68 arc(28.43,43.21) 28.95,43.42 29.83,43.42 arc(30.76,43.81) 31.14,44.73 31.14,46.83 arc(31.22,47.25) 31.46,47.61 arc(31.75,47.89) 32.06,48.15 arc(32.93,48.89) 33.76,49.67 34.64,49.67 arc(35,49.82) 35.15,50.19 35.15,51.45 arc(34.96,51.92) 34.49,52.11 32.85,52.11 arc(32.49,52.26) 32.34,52.63 U12.4 arc(32.24,53.87) 31.94,54.31 31.51,54.74 arc(30.95,55.11) 30.29,55.25 U12.1
CH1_1: length 13.4
  Top Layer w0.203: U14.4 arc(27.58,41.23) 27.58,41.25 27.58,42.8 arc(27.89,43.53) 28.62,43.83 29.69,43.83 arc(30.43,44.14) 30.73,44.88 30.73,47.54 arc(30.86,48.17) 31.22,48.71 32.18,49.67 arc(32.98,50.42) R23.2
CH1_2: length 6.3
  Top Layer w0.203: U14.12 28.21,47.4 arc(28.31,47.92) 28.6,48.35 arc(29.18,48.75) 29.87,48.91 arc(30.39,49.15) 30.6,49.67 arc(31.38,50.44) R24.2
CH1_3: length 5.5
  Top Layer w0.203: U14.13 27.56,47.64 arc(27.68,48.27) 28.04,48.81 28.82,49.59 arc(28.92,49.65) 29.02,49.67 arc(29.8,50.44) R25.2
CH1_4: length 5.1
  Top Layer w0.203: U14.14 26.91,48.37 arc(27.05,49.08) 27.44,49.67 arc(28.23,50.44) R26.2
CH1_5: length 5
  Top Layer w0.203: U14.15 26.26,49.15 arc(26.08,49.43) 25.87,49.67 arc(26.65,50.44) R27.2
CH1_ADC: length 33
  Top Layer w0.203: R54.2 arc(70.28,35.15) 70.26,35.14 67.37,35.14 arc(66.32,34.71) 65.89,33.67 65.89,27.83 arc(65.5,26.89) 64.57,26.51 55.57,26.51 arc(55.25,26.37) 55.12,26.05 arc(55.03,25.84) 54.82,25.75 R48.1 52.65,20.03 arc(52.58,19.87) 52.43,19.8 51.08,19.8 arc(51.08,19.8) U30.15
CH1_OUT: length 38.6
  Top Layer w0.203: U30.1 41.17,20.44 arc(40.65,20.66) 40.44,21.17 40.44,44.23 arc(40.26,44.67) 39.82,44.85 37.85,44.85 arc(37.84,44.85) R36.2 ; U30.1 48.07,20.44 arc(48.42,20.3) 48.56,19.95 48.56,19.09 arc(48.74,18.66) 49.17,18.48 51.06,18.48 arc(51.07,18.48) U30.13 ; U30.1 arc(45.34,20.46) 45.33,20.46
CH2_0: length 21.1
  Top Layer w0.203: U4.1 29.94,25.22 arc(30.73,25.06) 31.41,24.62 32.08,23.94 arc(32.27,23.66) U4.4 32.34,22.46 arc(32.45,22.2) 32.72,22.09 34.54,22.09 arc(34.87,21.95) 35,21.63 35,20 arc(34.88,19.72) 34.59,19.6 33.95,19.6 arc(33.94,19.6) R71.1 arc(33.09,18.88) 32.16,18.28 arc(31.37,17.53) 31.04,16.5 arc(30.7,15.12) 29.87,13.96 arc(29.38,13.53) 28.85,13.15 arc(28.21,12.36) U10.5
CH2_1: length 12.3
  Top Layer w0.203: R71.2 32.5,19.68 arc(32.42,19.63) R70.1 arc(31.48,18.68) 30.73,17.67 arc(30.58,17.35) 30.53,17.01 arc(30.5,16.42) 30.43,15.84 arc(30.09,14.99) 29.41,14.37 arc(28.58,13.79) 27.84,13.1 arc(27.63,12.79) 27.53,12.44 arc(27.48,11.89) U10.4
CH2_2: length 6.4
  Top Layer w0.203: U10.12 28.11,17.79 arc(28.19,18.16) 28.4,18.48 arc(28.73,18.71) 29.13,18.79 29.62,18.79 arc(29.88,18.84) 30.1,18.98 R69.1 arc(30.81,19.63) 30.89,19.68 R70.2
CH2_3: length 5.4
  Top Layer w0.203: R69.2 29.29,19.68 arc(29.21,19.63) R68.1 arc(29.03,19.59) 28.95,19.54 27.79,18.38 arc(27.55,18.02) 27.46,17.59 U10.13
CH2_4: length 4.9
  Top Layer w0.203: R68.2 27.68,19.68 arc(27.6,19.63) R67.1 arc(27.03,18.91) 26.82,18.07 arc(26.81,17.58) U10.14
CH2_5: length 4.9
  Top Layer w0.203: U10.15 26.16,19.36 arc(26.09,19.54) R66.1 arc(26,19.63) 26.08,19.68 R67.2
CH2_ADC: length 26.9
  Top Layer w0.203: R58.2 67.38,27.74 arc(66.93,27.56) 66.75,27.12 66.75,26.46 arc(66.55,25.96) 66.05,25.75 R50.1 57.1,19.85 arc(56.89,19.35) 56.39,19.14 U30.14
CH2_OUT: length 18.7
  Top Layer w0.203: R78.2 42.13,14.93 arc(42.73,15.18) 42.98,15.78 42.98,18.88 arc(43.25,19.53) 43.9,19.8 45.34,19.8 arc(45.34,19.8) U30.2 47.51,19.79 arc(47.86,19.65) 48.01,19.29 48.01,18.6 arc(48.23,18.05) 48.78,17.82 51.05,17.82 arc(51.07,17.83) U30.12
DA0: length 28.5
  Top Layer w0.203: v1(49.68,36.92) 49.79,36.82 U26.37 ; v1(49.78,58.66) 47.74,58.66
  Bottom Layer w0.203: v1(49.78,58.66) 51.56,58.66 52.58,57.65 52.58,47.22 49.28,43.91 49.28,37.33 v1(49.68,36.92)
DA1: length 28.5
  Top Layer w0.203: v1(48.97,36.82) 49.47,36.32 U26.38 ; v1(49.22,58.16) 47.75,58.16
  Bottom Layer w0.203: v1(49.22,58.16) 51.36,58.16 52.07,57.44 52.07,47.44 48.82,44.19 48.82,37.02 49.02,36.82
DA2: length 28.5
  Top Layer w0.203: v1(49.02,35.91) 49.11,35.82 U26.39 ; v1(49.78,57.65) 47.76,57.65
  Bottom Layer w0.203: v1(49.78,57.65) 51.1,57.65 51.56,57.19 51.56,47.65 48.36,44.45 48.36,36.57 v1(49.02,35.91)
DA3: length 28.7
  Top Layer w0.203: v1(48.21,35.75) 48.64,35.32 U26.40 ; 47.69,57.14 v1(49.28,57.14)
  Bottom Layer w0.203: v1(48.21,35.75) 47.9,36.06 47.9,44.75 51.1,47.94 51.1,56.99 50.95,57.14 v1(49.28,57.14)
DA4: length 28.5
  Top Layer w0.203: 50.39,56.63 47.72,56.63 ; v1(48.36,34.84) 48.38,34.82 U26.41
  Bottom Layer w0.203: v1(48.36,34.84) 47.45,35.75 47.45,45 50.65,48.2 50.65,56.43 v1(50.44,56.63)
DA5: length 28.6
  Top Layer w0.203: v1(47.5,34.74) 47.92,34.32 U26.42 ; 47.69,56.16 49.8,56.16 49.94,56.02
  Bottom Layer w0.203: v1(49.94,56.07) 50.19,55.82 50.19,48.45 46.99,45.25 46.99,35.25 v1(47.5,34.74)
DA6: length 28.4
  Top Layer w0.203: v1(47.65,33.87) 47.71,33.82 U26.43 ; v1(49.43,55.62) 47.79,55.62 47.74,55.67
  Bottom Layer w0.203: v1(49.43,55.62) 49.73,55.31 49.73,48.66 46.53,45.46 46.53,34.84 47.5,33.87 v1(47.65,33.87)
DA7: length 28.4
  Top Layer w0.203: v1(46.74,33.77) 47.19,33.32 U26.44 ; U6.62 48.95,55.13 v1(48.97,55.11)
  Bottom Layer w0.203: v1(48.97,55.11) 49.28,54.8 49.28,48.86 46.08,45.66 46.08,34.43 v1(46.74,33.77)
DAC_TRIG: length 53.9
  Top Layer w0.203: v1(74.83,42.05) 75.34,42.05 76.08,41.3 R53.1 ; v1(58.72,63.64) 59.22,63.15 U6.30 ; R53.1 77.57,33.74 77.57,28.92 R57.1 ; R53.1 76.27,35.23
  Bottom Layer w0.203: v1(74.83,42.05) 74.57,41.8 63.05,41.8 59.23,45.61 59.23,46.36 58.72,46.87 58.72,48.86 58.93,49.06 58.93,60.29 58.72,60.49 v1(58.72,63.64)
DB0: length 16.8
  Top Layer w0.203: U26.24 59.74,36.82 59.94,37.02 59.94,38.2 58.68,39.46 54.71,39.46 51.74,42.43 51.74,47.16
DB1: length 17.4
  Top Layer w0.203: 52.24,47.16 52.24,42.69 55.02,39.92 58.83,39.92 60.35,38.39 60.35,36.77 59.9,36.32 U26.23
DB2: length 18.1
  Top Layer w0.203: 52.74,47.16 52.73,47.15 52.73,42.97 55.32,40.38 59.03,40.38 60.76,38.65 60.76,36.46 60.11,35.82 U26.22
DB3: length 18.8
  Top Layer w0.203: U26.21 60.37,35.32 61.11,36.06 61.11,38.9 59.18,40.83 55.63,40.83 53.24,43.22 53.24,47.16 53.24,47.16
DB4: length 19.4
  Top Layer w0.203: 53.74,47.16 53.74,43.43 55.88,41.29 59.38,41.29 61.52,39.16 61.52,35.86 60.48,34.82 U26.20 59.13,34.84
DB5: length 20.1
  Top Layer w0.203: 54.24,47.16 54.24,43.64 56.13,41.75 59.54,41.75 61.93,39.36 61.93,35.65 60.59,34.32 U26.19
DB6: length 20.7
  Top Layer w0.203: 54.74,47.16 54.74,43.85 56.39,42.2 59.69,42.2 62.33,39.56 62.33,35.5 60.65,33.82 U26.18
DB7: length 21.4
  Top Layer w0.203: 55.24,47.16 55.24,44.06 56.64,42.66 59.84,42.66 62.79,39.72 62.79,35.25 60.86,33.32 U26.17
EC1_A: length 10.4
  Top Layer w0.203: U6.22 65.06,59.13 67.24,56.95 FPC1.16
EC1_B: length 10.4
  Top Layer w0.203: FPC1.17 67.5,57.45 65.32,59.63 U6.23
EC1_KEY: length 11.6
  Top Layer w0.203: FPC1.8 71.38,52.95 69.72,51.3 69.72,50.49 68.65,49.42 63.91,49.42 63.69,49.63 U6.3
EC2_A: length 20.6
  Top Layer w0.203: FPC1.4 71.54,50.95 70.94,50.36 70.94,49.98 69.16,48.2 66.72,48.2 63.12,44.59 57.58,44.59 56.22,45.96 U6.90
EC2_B: length 21.1
  Top Layer w0.203: U6.89 55.72,46.03 57.46,44.29 63.24,44.29 66.85,47.89 69.28,47.89 71.25,49.86 71.25,50.14 71.56,50.45 FPC1.3
EC2_KEY: length 11.8
  Top Layer w0.203: FPC1.9 71.35,53.45 69.42,51.53 69.42,50.61 68.53,49.72 64.06,49.72 63.65,50.13 U6.4
EC3_A: length 12
  Top Layer w0.203: U6.5 63.76,50.63 64.36,50.03 68.4,50.03 69.11,50.74 69.11,51.73 71.34,53.95 FPC1.10
EC3_B: length 9.9
  Top Layer w0.203: FPC1.13 65.25,55.45 64.43,54.63 U6.13
EC3_KEY: length 10.4
  Top Layer w0.203: FPC1.18 67.82,57.95 65.64,60.13 U6.24
EC4_A: length 10
  Top Layer w0.203: U6.18 62.78,57.14 64.87,57.14 66.06,55.95 FPC1.14
EC4_B: length 27.1
  Top Layer w0.203: v1(66.29,56.53) 66.37,56.45 FPC1.15 ; v1(60.25,55.67) 58.88,55.67 v1(58.42,56.12) ; v1(55.27,59.98) 51.41,59.98 50.7,60.7 50.7,62.16 U6.47
  Bottom Layer w0.203: v1(58.42,56.12) 57.15,56.12 56.24,57.04 56.24,59.63 55.88,59.98 v1(55.27,59.98) ; v1(60.25,55.67) 65.43,55.67 v1(66.29,56.53)
EC4_KEY: length 20.2
  Top Layer w0.203: FPC1.5 71.48,51.45 70.64,50.61 70.64,50.11 69.03,48.5 66.6,48.5 62.99,44.9 57.71,44.9 56.72,45.89 U6.91
G2: length 28
  Top Layer w0.203: U6.15 61.44,55.63 61.11,55.96 61.11,56.78 v1(61.47,57.14)
  Bottom Layer w0.203: J2.15 54.82,71 56.69,69.13 60,69.13 61.47,67.66 61.47,59.87 60.6,59.01 60.6,57.65 61.11,57.14 v1(61.47,57.14)
G3: length 14.5
  Top Layer w0.203: v1(54.36,70.75) 53.75,70.14 53.75,62.21 U6.41
  Bottom Layer w0.203: J2.16 54.32,70.79 v1(54.36,70.75)
G4: length 19.7
  Top Layer w0.203: v1(54.91,63.64) v1(54.91,69.43) ; v1(51.21,61.1) 51.21,62.17 U6.46
  Bottom Layer w0.203: v1(54.91,63.64) 54.91,62.53 53.49,61.1 v1(51.21,61.1) ; v1(54.91,69.43) 53.82,70.53 J2.17
G5: length 28.4
  Top Layer w0.203: v1(61.62,56.17) 62.73,56.17 U6.16
  Bottom Layer w0.203: v1(61.62,56.17) 61.33,56.17 60.25,57.26 60.25,59.2 60.91,59.86 60.91,67.3 59.64,68.57 54.76,68.57 53.32,70.01 J2.18
G6: length 31.5
  Top Layer w0.203: v1(52.78,71.01) 51,69.23 45.72,69.23 44.4,67.91 v1(44.3,67.91) ; v1(45.26,54.7) 45.26,54.63 45.76,54.13 U6.64
  Bottom Layer w0.203: v1(52.78,71.01) 52.82,71.05 J2.19 ; v1(44.3,67.91) 44.3,65.67 45.26,64.71 v1(45.26,54.7)
G7: length 25.5
  Top Layer w0.203: U6.54 46.17,59.13 v1(45.77,59.53) ; v1(51.82,70.96) 50.6,69.74 45.47,69.74 v1(44.81,69.08)
  Bottom Layer w0.203: J2.20 52.32,71.46 v1(51.82,70.96) ; v1(44.81,69.08) 44.81,65.93 45.77,64.96 v1(45.77,59.53)
HC_A1: length 34.8
  Top Layer w0.203: v1(43.69,62.58) 44.35,62.58 46.29,60.63 U6.51 ; v1(28.86,45.76) U14.11
  Bottom Layer w0.203: v1(43.69,62.58) 40.54,62.58 37.34,59.38 30.48,59.38 28.86,57.75 v1(28.86,45.76)
HC_A2: length 159.2
  Top Layer w0.203: v3(23.88,8.93) 23.88,9.39 24.44,9.95 24.44,13.4 25.96,14.93 28.09,14.93 28.76,15.59 U10.11 ; v1(55.98,65.62) 55.78,65.42 55.78,64.17 56.22,63.73 U6.36 ; v1(62.08,65.47) v1(58.67,65.47)
  Inner2 w0.203: v1(77.52,65.52) 78.13,65.52 78.49,65.17 78.49,61.35 78.03,60.9 78.03,59.91 78.49,59.45 78.49,9.03 70.97,1.51 27.9,1.51 27.86,1.56 v1(24.44,1.56)
  Bottom Layer w0.203: v1(77.52,65.52) 77.47,65.47 v1(62.08,65.47) ; v1(55.98,65.62) 58.52,65.62 v1(58.67,65.47) ; v1(24.44,1.56) 24.44,1.57 24.44,7.87 23.88,8.43 v3(23.88,8.93)
HC_B1: length 33.6
  Top Layer w0.203: U6.52 46.36,60.13 44.58,61.92 v1(43.69,61.92) ; U14.10 29.51,46.94 v1(29.51,45.81)
  Bottom Layer w0.203: v1(29.51,45.81) 29.51,57.65 30.73,58.87 37.59,58.87 40.64,61.92 v1(43.69,61.92)
HC_B2: length 161.1
  Top Layer w0.203: v1(55.68,66.23) 55.37,65.93 55.37,64.02 55.72,63.67 U6.37 ; v1(62.74,66.13) v1(58.67,66.13) ; v3(24.74,8.92) 24.74,13.28 26.09,14.62 28.22,14.62 29.41,15.81 U10.10
  Inner2 w0.203: v1(77.52,66.23) 78.03,66.23 78.79,65.47 78.79,61.23 78.33,60.77 78.33,60.04 78.79,59.58 78.79,8.91 71.09,1.21 25.45,1.21 v1(25.25,1.01)
  Bottom Layer w0.203: v1(58.67,66.13) 58.57,66.23 v1(55.68,66.23) ; v1(25.25,1.01) 25.25,2.18 24.74,2.69 v3(24.74,8.92) ; v1(77.52,66.23) 77.42,66.13 v1(62.74,66.13)
HC_C1: length 32.7
  Top Layer w0.203: v1(43.69,61.25) 44.81,61.25 46.43,59.63 U6.53 ; U14.9 30.18,46.93 v1(30.18,45.76)
  Bottom Layer w0.203: v1(30.18,45.76) 30.18,57.55 30.99,58.36 37.85,58.36 40.74,61.25 v1(43.69,61.25)
HC_C2: length 155.6
  Top Layer w0.203: v1(58.42,59.73) 59.15,59.73 59.96,60.54 60.96,60.54 61.62,61.2 v1(62.38,61.2) ; U6.38 55.22,61.25 v2(55.37,61.1) ; v3(25.55,8.92) 25.55,9.44 25.05,9.94 25.05,13.15 26.21,14.32 28.34,14.32 30.06,16.03 U10.9
  Inner2 w0.203: 79.1,11.22 79.1,10.52 ; 79.1,11.22 79.1,8.78 71.22,0.9 26.16,0.9 v1(25.96,0.7) ; 79.1,11.22 79.1,60.29 v1(78.99,60.39)
  Bottom Layer w0.203: v2(55.37,61.1) 56.13,60.34 57.76,60.34 58.37,59.73 v1(58.42,59.73) ; v1(62.38,61.2) 78.18,61.2 v1(78.99,60.39) ; v3(25.55,8.92) 25.55,8.44 25.05,7.93 25.05,2.89 25.96,1.98 v1(25.96,0.7)
HC_S0: length 70.1
  Top Layer w0.203: U6.97 59.74,47.06 v2(59.74,46.02) ; v1(76.35,18.18) 75.37,17.19 U30.11
  Inner2 w0.203: v1(76.35,18.18) 77.22,19.04 77.22,39.94 76.3,40.85 76.3,41.8 v1(75.54,42.56)
  Bottom Layer w0.203: v2(59.74,46.02) 59.74,45.54 63.18,42.1 74.16,42.1 74.62,42.56 v1(75.54,42.56)
HC_S1: length 71.2
  Top Layer w0.203: v1(77.16,18.18) 75.53,16.54 U30.10 ; U6.98 60.22,46.18 60.35,46.05 v2(60.35,46.02)
  Inner2 w0.203: v1(77.16,18.18) 77.52,18.53 77.52,40.06 76.61,40.98 76.61,42.21 75.75,43.07 v1(74.83,43.07)
  Bottom Layer w0.203: v1(74.83,43.07) 74.54,43.07 73.88,42.41 63.3,42.41 60.35,45.36 v2(60.35,46.02)
IO_CLK1: length 33.3
  Top Layer w0.203: 54.72,61.29 54.72,61.26 arc(54.7,61.27) 54.72,61.29 ; 54.72,61.29 U6.39 ; 54.72,61.29 arc(54.73,61.28) 54.72,61.26 ; v1(45.57,36.01) R47.2
  Bottom Layer w0.203: v1(45.57,36.01) 45.57,45.04 arc(45.77,46.03) 46.33,46.88 arc(47.76,49.02) 48.26,51.54 48.26,59.07 arc(48.56,59.79) 49.28,60.09 54.15,60.09 arc(54.55,60.25) 54.71,60.65 v1(54.71,61.25)
IO_CLK2: length 33.8
  Top Layer w0.203: R49.1 63.7,41.08 arc(63.59,41.35) 63.32,41.46 62.83,41.46 arc(62.45,41.84) 62.83,42.22 63.32,42.22 arc(63.59,42.33) 63.7,42.6 v1(63.7,42.92) ; U6.69 60.74,51.63 v4(60.81,51.7)
  Bottom Layer w0.203: v1(63.7,42.92) 63.7,50.74 arc(63.42,51.42) 62.74,51.7 v4(60.81,51.7)
IO_OH1: length 187.8
  Top Layer w0.203: v1(3.5,37.63) 3.51,37.64 U9.1 ; U6.80 51.21,47.07 v2(51.21,44.8)
  Inner2 w0.203: v1(3.5,37.63) 2.74,37.63 1.83,36.72 1.83,27.32 1.63,27.12 1.63,4.13 4.8,0.96 22.08,0.96 23.5,2.38 27.95,2.38 28.2,2.12 70.71,2.12 77.83,9.24 77.83,40.48 v1(77.11,41.19)
  Bottom Layer w0.203: v2(51.21,44.8) 51.56,44.44 59.54,44.44 62.8,41.19 v1(77.11,41.19)
